# EAGLE schematic daughterboard (EAGLE 9.6.2)
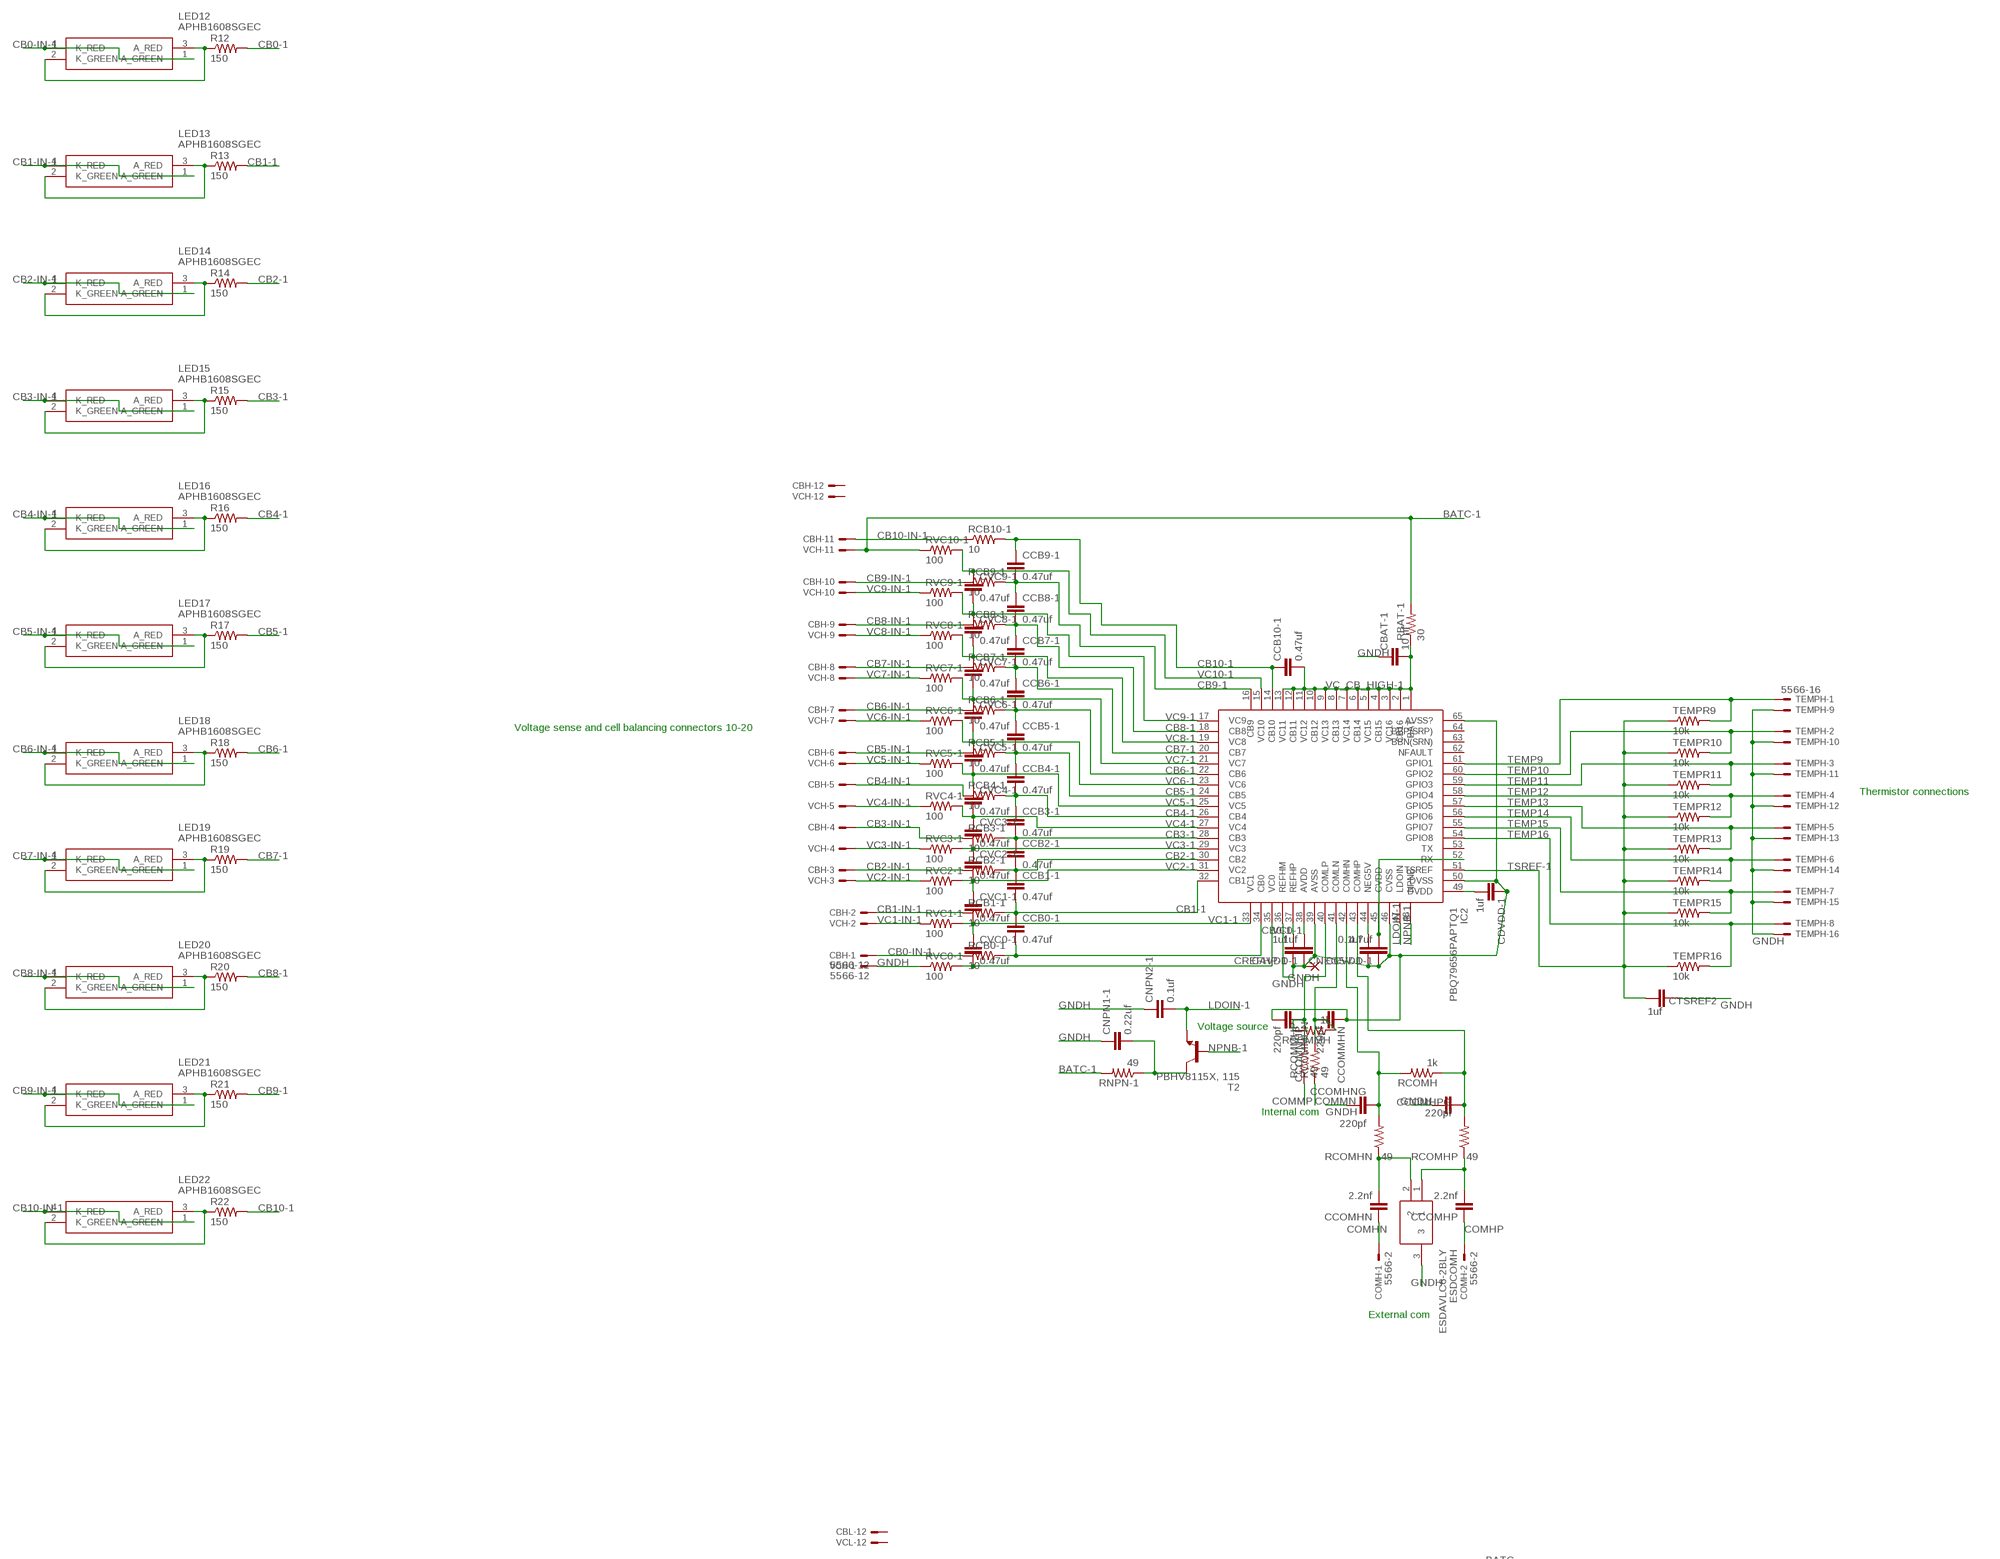
[diagram p0: schematic, sheet 1, part 1 of 2]
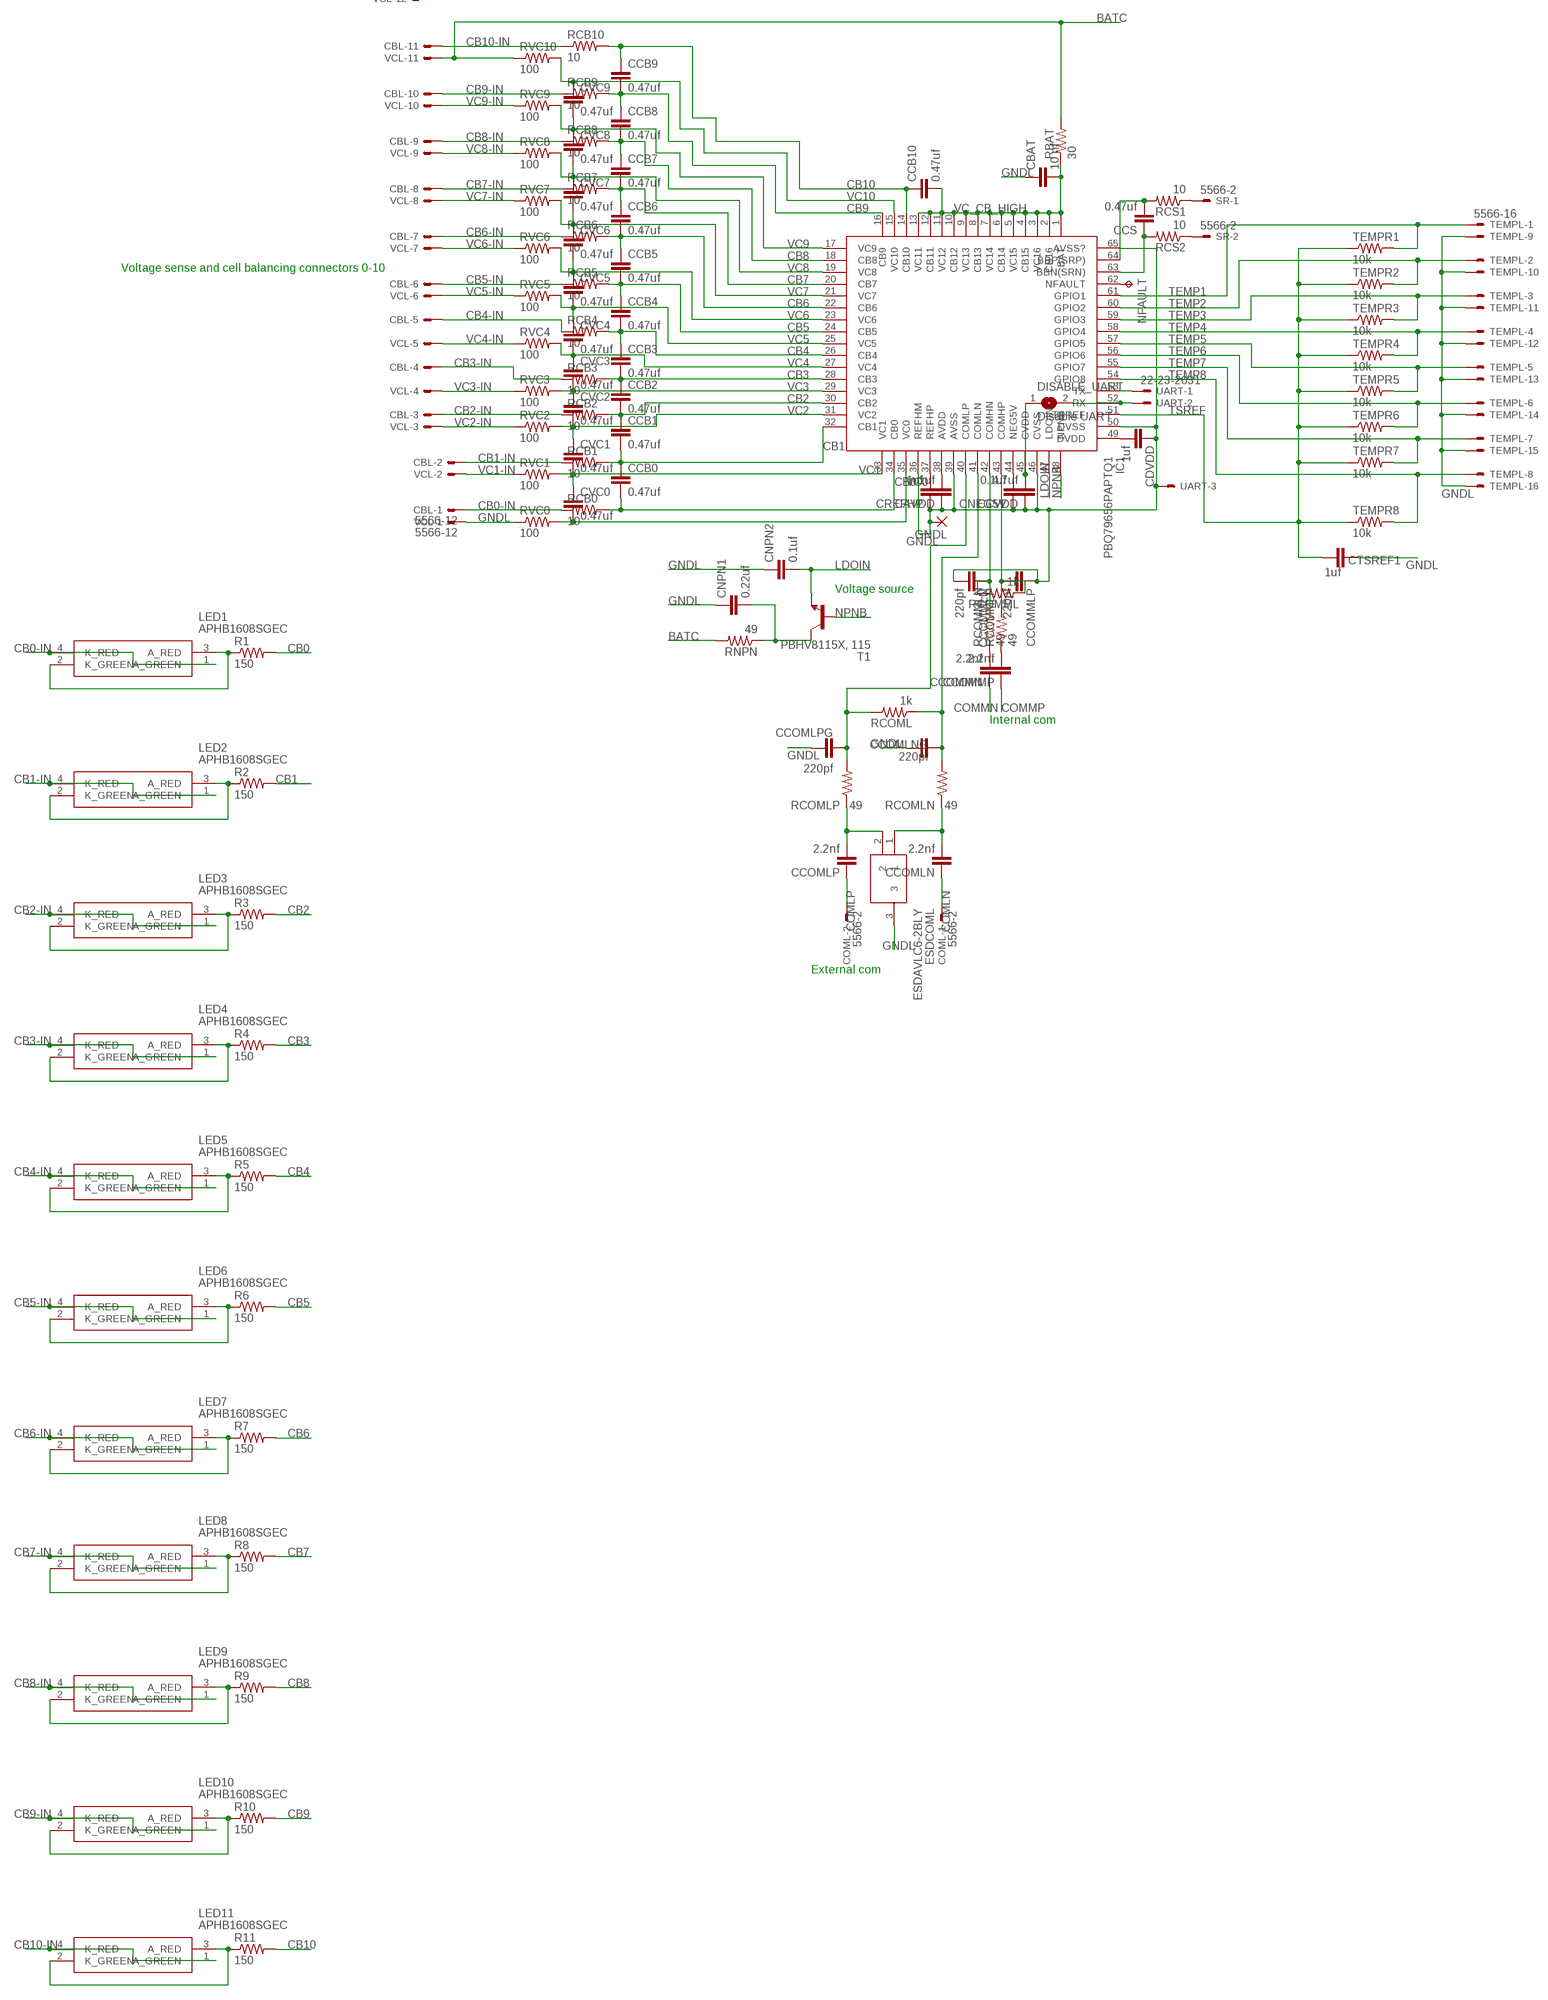
[diagram p1: schematic, sheet 1, part 2 of 2]

## Parts
CAVDD  1uf  C-EUC0603  [C0603]
CAVDD-1  1uf  C-EUC0603  [C0603]
CBAT  10 nf  C-EUC0603  [C0603]
CBAT-1  10 nf  C-EUC0603  [C0603]
CBH  5566-12  [5566-12]
CBL  5566-12  [5566-12]
CCB0  0.47uf  C-EUC0603  [C0603]
CCB0-1  0.47uf  C-EUC0603  [C0603]
CCB1  0.47uf  C-EUC0603  [C0603]
CCB1-1  0.47uf  C-EUC0603  [C0603]
CCB2  0.47uf  C-EUC0603  [C0603]
CCB2-1  0.47uf  C-EUC0603  [C0603]
CCB3  0.47uf  C-EUC0603  [C0603]
CCB3-1  0.47uf  C-EUC0603  [C0603]
CCB4  0.47uf  C-EUC0603  [C0603]
CCB4-1  0.47uf  C-EUC0603  [C0603]
CCB5  0.47uf  C-EUC0603  [C0603]
CCB5-1  0.47uf  C-EUC0603  [C0603]
CCB6  0.47uf  C-EUC0603  [C0603]
CCB6-1  0.47uf  C-EUC0603  [C0603]
CCB7  0.47uf  C-EUC0603  [C0603]
CCB7-1  0.47uf  C-EUC0603  [C0603]
CCB8  0.47uf  C-EUC0603  [C0603]
CCB8-1  0.47uf  C-EUC0603  [C0603]
CCB9  0.47uf  C-EUC0603  [C0603]
CCB9-1  0.47uf  C-EUC0603  [C0603]
CCB10  0.47uf  C-EUC0603  [C0603]
CCB10-1  0.47uf  C-EUC0603  [C0603]
CCOMHN  2.2nf  C-EUC0603  [C0603]
CCOMHNG  220pf  C-EUC0603  [C0603]
CCOMHP  2.2nf  C-EUC0603  [C0603]
CCOMHPG  220pf  C-EUC0603  [C0603]
CCOMLN  2.2nf  C-EUC0603  [C0603]
CCOMLNG  220pf  C-EUC0603  [C0603]
CCOMLP  2.2nf  C-EUC0603  [C0603]
CCOMLPG  220pf  C-EUC0603  [C0603]
CCOMMHN  220pf  C-EUC0603  [C0603]
CCOMMHP  220pf  C-EUC0603  [C0603]
CCOMMLN  220pf  C-EUC0603  [C0603]
CCOMMLP  220pf  C-EUC0603  [C0603]
CCOMMN  2.2nf  C-EUC0603  [C0603]
CCOMMP  2.2nf  C-EUC0603  [C0603]
CCS  0.47uf  C-EUC0603  [C0603]
CCVDD  4.7uf  C-EUC0603  [C0603]
CCVDD-1  4.7uf  C-EUC0603  [C0603]
CDVDD  1uf  C-EUC0603  [C0603]
CDVDD-1  1uf  C-EUC0603  [C0603]
CNEG5V  0.1uf  C-EUC0603  [C0603]
CNEG5V-1  0.1uf  C-EUC0603  [C0603]
CNPN1  0.22uf  C-EUC0603  [C0603]
CNPN1-1  0.22uf  C-EUC0603  [C0603]
CNPN2  0.1uf  C-EUC0603  [C0603]
CNPN2-1  0.1uf  C-EUC0603  [C0603]
COMH  5566-2  [5566-2]
COML  5566-2  [5566-2]
CREFHP  1uf  C-EUC0603  [C0603]
CREFHP-1  1uf  C-EUC0603  [C0603]
CTSREF1  1uf  C-EUC0603  [C0603]
CTSREF2  1uf  C-EUC0603  [C0603]
CVC0  0.47uf  C-EUC0603  [C0603]
CVC0-1  0.47uf  C-EUC0603  [C0603]
CVC1  0.47uf  C-EUC0603  [C0603]
CVC1-1  0.47uf  C-EUC0603  [C0603]
CVC2  0.47uf  C-EUC0603  [C0603]
CVC2-1  0.47uf  C-EUC0603  [C0603]
CVC3  0.47uf  C-EUC0603  [C0603]
CVC3-1  0.47uf  C-EUC0603  [C0603]
CVC4  0.47uf  C-EUC0603  [C0603]
CVC4-1  0.47uf  C-EUC0603  [C0603]
CVC5  0.47uf  C-EUC0603  [C0603]
CVC5-1  0.47uf  C-EUC0603  [C0603]
CVC6  0.47uf  C-EUC0603  [C0603]
CVC6-1  0.47uf  C-EUC0603  [C0603]
CVC7  0.47uf  C-EUC0603  [C0603]
CVC7-1  0.47uf  C-EUC0603  [C0603]
CVC8  0.47uf  C-EUC0603  [C0603]
CVC8-1  0.47uf  C-EUC0603  [C0603]
CVC9  0.47uf  C-EUC0603  [C0603]
CVC9-1  0.47uf  C-EUC0603  [C0603]
DISABLE_UART  Disable UART  SJ  [SJ]
ESDCOMH  ESDAVLC6-2BLY  [SOT95P255X150-3N]
ESDCOML  ESDAVLC6-2BLY  [SOT95P255X150-3N]
GNDH  SMD5  [SMD2,54-5,08]
GNDL  SMD5  [SMD2,54-5,08]
IC1  PBQ79656PAPTQ1  [QFP50P1200X1200X120-65N]
IC2  PBQ79656PAPTQ1  [QFP50P1200X1200X120-65N]
LED1  APHB1608SGEC  [APHB1608SGEC]
LED2  APHB1608SGEC  [APHB1608SGEC]
LED3  APHB1608SGEC  [APHB1608SGEC]
LED4  APHB1608SGEC  [APHB1608SGEC]
LED5  APHB1608SGEC  [APHB1608SGEC]
LED6  APHB1608SGEC  [APHB1608SGEC]
LED7  APHB1608SGEC  [APHB1608SGEC]
LED8  APHB1608SGEC  [APHB1608SGEC]
LED9  APHB1608SGEC  [APHB1608SGEC]
LED10  APHB1608SGEC  [APHB1608SGEC]
LED11  APHB1608SGEC  [APHB1608SGEC]
LED12  APHB1608SGEC  [APHB1608SGEC]
LED13  APHB1608SGEC  [APHB1608SGEC]
LED14  APHB1608SGEC  [APHB1608SGEC]
LED15  APHB1608SGEC  [APHB1608SGEC]
LED16  APHB1608SGEC  [APHB1608SGEC]
LED17  APHB1608SGEC  [APHB1608SGEC]
LED18  APHB1608SGEC  [APHB1608SGEC]
LED19  APHB1608SGEC  [APHB1608SGEC]
LED20  APHB1608SGEC  [APHB1608SGEC]
LED21  APHB1608SGEC  [APHB1608SGEC]
LED22  APHB1608SGEC  [APHB1608SGEC]
NFAULT  TPB2,54  [B2,54]
R1  150  R-US_R0603  [R0603]
R2  150  R-US_R0603  [R0603]
R3  150  R-US_R0603  [R0603]
R4  150  R-US_R0603  [R0603]
R5  150  R-US_R0603  [R0603]
R6  150  R-US_R0603  [R0603]
R7  150  R-US_R0603  [R0603]
R8  150  R-US_R0603  [R0603]
R9  150  R-US_R0603  [R0603]
R10  150  R-US_R0603  [R0603]
R11  150  R-US_R0603  [R0603]
R12  150  R-US_R0603  [R0603]
R13  150  R-US_R0603  [R0603]
R14  150  R-US_R0603  [R0603]
R15  150  R-US_R0603  [R0603]
R16  150  R-US_R0603  [R0603]
R17  150  R-US_R0603  [R0603]
R18  150  R-US_R0603  [R0603]
R19  150  R-US_R0603  [R0603]
R20  150  R-US_R0603  [R0603]
R21  150  R-US_R0603  [R0603]
R22  150  R-US_R0603  [R0603]
RBAT  30  R-US_R0603  [R0603]
RBAT-1  30  R-US_R0603  [R0603]
RCB0  10  R-US_R1210  [R1210]
RCB0-1  10  R-US_R1210  [R1210]
RCB1  10  R-US_R1210  [R1210]
RCB1-1  10  R-US_R1210  [R1210]
RCB2  10  R-US_R1210  [R1210]
RCB2-1  10  R-US_R1210  [R1210]
RCB3  10  R-US_R1210  [R1210]
RCB3-1  10  R-US_R1210  [R1210]
RCB4  10  R-US_R1210  [R1210]
RCB4-1  10  R-US_R1210  [R1210]
RCB5  10  R-US_R1210  [R1210]
RCB5-1  10  R-US_R1210  [R1210]
RCB6  10  R-US_R1210  [R1210]
RCB6-1  10  R-US_R1210  [R1210]
RCB7  10  R-US_R1210  [R1210]
RCB7-1  10  R-US_R1210  [R1210]
RCB8  10  R-US_R1210  [R1210]
RCB8-1  10  R-US_R1210  [R1210]
RCB9  10  R-US_R1210  [R1210]
RCB9-1  10  R-US_R1210  [R1210]
RCB10  10  R-US_R1210  [R1210]
RCB10-1  10  R-US_R1210  [R1210]
RCOMH  1k  R-US_R0603  [R0603]
RCOMHN  49  R-US_R0603  [R0603]
RCOMHP  49  R-US_R0603  [R0603]
RCOML  1k  R-US_R0603  [R0603]
RCOMLN  49  R-US_R0603  [R0603]
RCOMLP  49  R-US_R0603  [R0603]
RCOMMH  1k  R-US_R0603  [R0603]
RCOMMHN  49  R-US_R0603  [R0603]
RCOMMHP  49  R-US_R0603  [R0603]
RCOMML  1k  R-US_R0603  [R0603]
RCOMMLN  49  R-US_R0603  [R0603]
RCOMMLP  49  R-US_R0603  [R0603]
RCS1  10  R-US_R0603  [R0603]
RCS2  10  R-US_R0603  [R0603]
RNPN  49  R-US_R0603  [R0603]
RNPN-1  49  R-US_R0603  [R0603]
RVC0  100  R-US_R0603  [R0603]
RVC0-1  100  R-US_R0603  [R0603]
RVC1  100  R-US_R0603  [R0603]
RVC1-1  100  R-US_R0603  [R0603]
RVC2  100  R-US_R0603  [R0603]
RVC2-1  100  R-US_R0603  [R0603]
RVC3  100  R-US_R0603  [R0603]
RVC3-1  100  R-US_R0603  [R0603]
RVC4  100  R-US_R0603  [R0603]
RVC4-1  100  R-US_R0603  [R0603]
RVC5  100  R-US_R0603  [R0603]
RVC5-1  100  R-US_R0603  [R0603]
RVC6  100  R-US_R0603  [R0603]
RVC6-1  100  R-US_R0603  [R0603]
RVC7  100  R-US_R0603  [R0603]
RVC7-1  100  R-US_R0603  [R0603]
RVC8  100  R-US_R0603  [R0603]
RVC8-1  100  R-US_R0603  [R0603]
RVC9  100  R-US_R0603  [R0603]
RVC9-1  100  R-US_R0603  [R0603]
RVC10  100  R-US_R0603  [R0603]
RVC10-1  100  R-US_R0603  [R0603]
SR  5566-2  [5566-2]
T1  PBHV8115X, 115  BC868-NPN-SOT89-BCE  [SOT89-BCE]
T2  PBHV8115X, 115  BC868-NPN-SOT89-BCE  [SOT89-BCE]
TEMPH  5566-16  [5566-16]
TEMPL  5566-16  [5566-16]
TEMPR1  10k  R-US_R0603  [R0603]
TEMPR2  10k  R-US_R0603  [R0603]
TEMPR3  10k  R-US_R0603  [R0603]
TEMPR4  10k  R-US_R0603  [R0603]
TEMPR5  10k  R-US_R0603  [R0603]
TEMPR6  10k  R-US_R0603  [R0603]
TEMPR7  10k  R-US_R0603  [R0603]
TEMPR8  10k  R-US_R0603  [R0603]
TEMPR9  10k  R-US_R0603  [R0603]
TEMPR10  10k  R-US_R0603  [R0603]
TEMPR11  10k  R-US_R0603  [R0603]
TEMPR12  10k  R-US_R0603  [R0603]
TEMPR13  10k  R-US_R0603  [R0603]
TEMPR14  10k  R-US_R0603  [R0603]
TEMPR15  10k  R-US_R0603  [R0603]
TEMPR16  10k  R-US_R0603  [R0603]
UART  22-23-2031  [22-23-2031]
VCH  5566-12  [5566-12]
VCL  5566-12  [5566-12]

## Nets
BATC: RBAT.2 RNPN.2 RVC10.1 VCL.11
BATC-1: RBAT-1.2 RNPN-1.2 RVC10-1.1 VCH.11
CB0: CCB0.2 IC1.34(CB0) R1.2 RCB0.2
CB0-1: CCB0-1.2 IC2.34(CB0) R12.2 RCB0-1.2
CB0-IN: CBL.1 LED1.1(A_GREEN) LED1.4(K_RED) RCB0.1
CB0-IN-1: CBH.1 LED12.1(A_GREEN) LED12.4(K_RED) RCB0-1.1
CB1: CCB0.1 CCB1.2 IC1.32(CB1) R2.2 RCB1.2
CB1-1: CCB0-1.1 CCB1-1.2 IC2.32(CB1) R13.2 RCB1-1.2
CB1-IN: CBL.2 LED2.1(A_GREEN) LED2.4(K_RED) RCB1.1
CB1-IN-1: CBH.2 LED13.1(A_GREEN) LED13.4(K_RED) RCB1-1.1
CB2: CCB1.1 CCB2.2 IC1.30(CB2) R3.2 RCB2.2
CB2-1: CCB1-1.1 CCB2-1.2 IC2.30(CB2) R14.2 RCB2-1.2
CB2-IN: CBL.3 LED3.1(A_GREEN) LED3.4(K_RED) RCB2.1
CB2-IN-1: CBH.3 LED14.1(A_GREEN) LED14.4(K_RED) RCB2-1.1
CB3: CCB2.1 CCB3.2 IC1.28(CB3) R4.2 RCB3.2
CB3-1: CCB2-1.1 CCB3-1.2 IC2.28(CB3) R15.2 RCB3-1.2
CB3-IN: CBL.4 LED4.1(A_GREEN) LED4.4(K_RED) RCB3.1
CB3-IN-1: CBH.4 LED15.1(A_GREEN) LED15.4(K_RED) RCB3-1.1
CB4: CCB3.1 CCB4.2 IC1.26(CB4) R5.2 RCB4.2
CB4-1: CCB3-1.1 CCB4-1.2 IC2.26(CB4) R16.2 RCB4-1.2
CB4-IN: CBL.5 LED5.1(A_GREEN) LED5.4(K_RED) RCB4.1
CB4-IN-1: CBH.5 LED16.1(A_GREEN) LED16.4(K_RED) RCB4-1.1
CB5: CCB4.1 CCB5.2 IC1.24(CB5) R6.2 RCB5.2
CB5-1: CCB4-1.1 CCB5-1.2 IC2.24(CB5) R17.2 RCB5-1.2
CB5-IN: CBL.6 LED6.1(A_GREEN) LED6.4(K_RED) RCB5.1
CB5-IN-1: CBH.6 LED17.1(A_GREEN) LED17.4(K_RED) RCB5-1.1
CB6: CCB5.1 CCB6.2 IC1.22(CB6) R7.2 RCB6.2
CB6-1: CCB5-1.1 CCB6-1.2 IC2.22(CB6) R18.2 RCB6-1.2
CB6-IN: CBL.7 LED7.1(A_GREEN) LED7.4(K_RED) RCB6.1
CB6-IN-1: CBH.7 LED18.1(A_GREEN) LED18.4(K_RED) RCB6-1.1
CB7: CCB6.1 CCB7.2 IC1.20(CB7) R8.2 RCB7.2
CB7-1: CCB6-1.1 CCB7-1.2 IC2.20(CB7) R19.2 RCB7-1.2
CB7-IN: CBL.8 LED8.1(A_GREEN) LED8.4(K_RED) RCB7.1
CB7-IN-1: CBH.8 LED19.1(A_GREEN) LED19.4(K_RED) RCB7-1.1
CB8: CCB7.1 CCB8.2 IC1.18(CB8) R9.2 RCB8.2
CB8-1: CCB7-1.1 CCB8-1.2 IC2.18(CB8) R20.2 RCB8-1.2
CB8-IN: CBL.9 LED9.1(A_GREEN) LED9.4(K_RED) RCB8.1
CB8-IN-1: CBH.9 LED20.1(A_GREEN) LED20.4(K_RED) RCB8-1.1
CB9: CCB8.1 CCB9.2 IC1.16(CB9) R10.2 RCB9.2
CB9-1: CCB8-1.1 CCB9-1.2 IC2.16(CB9) R21.2 RCB9-1.2
CB9-IN: CBL.10 LED10.1(A_GREEN) LED10.4(K_RED) RCB9.1
CB9-IN-1: CBH.10 LED21.1(A_GREEN) LED21.4(K_RED) RCB9-1.1
CB10: CCB9.1 CCB10.1 IC1.14(CB10) R11.2 RCB10.2
CB10-1: CCB9-1.1 CCB10-1.1 IC2.14(CB10) R22.2 RCB10-1.2
CB10-IN: CBL.11 LED11.1(A_GREEN) LED11.4(K_RED) RCB10.1
CB10-IN-1: CBH.11 LED22.1(A_GREEN) LED22.4(K_RED) RCB10-1.1
COMHN: CCOMHN.1 COMH.1
COMHP: CCOMHP.1 COMH.2
COMLN: CCOMLN.1 COML.1
COMLP: CCOMLP.1 COML.2
COMMN: CCOMMN.1 RCOMMHN.1
COMMP: CCOMMP.1 RCOMMHP.1
CVDD: CCVDD.2 DISABLE_UART.1 IC1.45(CVDD)
CVDD-1: CCVDD-1.2 IC2.45(CVDD) IC2.52(RX)
GNDH: CAVDD-1.1 CBAT-1.1 CCOMHNG.1 CCOMHPG.1 CCOMMHN.1 CCOMMHP.2 CCVDD-1.1 CDVDD-1.1 CNEG5V-1.1 CNPN1-1.1 CNPN2-1.1 CREFHP-1.1 CTSREF2.1 ESDCOMH.3 GNDH.1(P) IC2.36(REFHM) IC2.39(AVSS) IC2.46(CVSS) IC2.50(DVSS) IC2.65(AVSS?) RVC0-1.1 TEMPH.9 TEMPH.10 TEMPH.11 TEMPH.12 TEMPH.13 TEMPH.14 TEMPH.15 TEMPH.16 VCH.1
GNDL: CAVDD.1 CBAT.1 CCOMLNG.1 CCOMLPG.1 CCOMMLN.2 CCOMMLP.1 CCVDD.1 CDVDD.1 CNEG5V.1 CNPN1.1 CNPN2.1 CREFHP.1 CTSREF1.1 ESDCOML.3 GNDL.1(P) IC1.36(REFHM) IC1.39(AVSS) IC1.46(CVSS) IC1.50(DVSS) IC1.65(AVSS?) RVC0.1 TEMPL.9 TEMPL.10 TEMPL.11 TEMPL.12 TEMPL.13 TEMPL.14 TEMPL.15 TEMPL.16 UART.3 VCL.1
LDOIN: CNPN2.2 IC1.47(LDOIN) T1.E
LDOIN-1: CNPN2-1.2 IC2.47(LDOIN) T2.E
N$1: CCOMHP.2 ESDCOMH.1 RCOMHP.1
N$2: CCOMHN.2 ESDCOMH.2 RCOMHN.1
N$3: DISABLE_UART.2 IC1.52(RX) UART.2
N$4: CCS.2 IC1.64(BBP(SRP)) RCS1.2
N$5: LED12.2(K_GREEN) LED12.3(A_RED) R12.1
N$6: LED2.2(K_GREEN) LED2.3(A_RED) R2.1
N$7: CCS.1 IC1.63(BBN(SRN)) RCS2.2
N$8: LED13.2(K_GREEN) LED13.3(A_RED) R13.1
N$9: IC1.53(TX) UART.1
N$10: IC1.62(NFAULT) NFAULT.TP
N$11: LED14.2(K_GREEN) LED14.3(A_RED) R14.1
N$12: LED3.2(K_GREEN) LED3.3(A_RED) R3.1
N$13: RCS2.1 SR.2
N$14: LED15.2(K_GREEN) LED15.3(A_RED) R15.1
N$15: LED16.2(K_GREEN) LED16.3(A_RED) R16.1
N$16: RCS1.1 SR.1
N$17: LED17.2(K_GREEN) LED17.3(A_RED) R17.1
N$18: LED4.2(K_GREEN) LED4.3(A_RED) R4.1
N$19: LED18.2(K_GREEN) LED18.3(A_RED) R18.1
N$20: LED19.2(K_GREEN) LED19.3(A_RED) R19.1
N$21: LED5.2(K_GREEN) LED5.3(A_RED) R5.1
N$22: LED20.2(K_GREEN) LED20.3(A_RED) R20.1
N$23: LED21.2(K_GREEN) LED21.3(A_RED) R21.1
N$24: LED6.2(K_GREEN) LED6.3(A_RED) R6.1
N$25: LED22.2(K_GREEN) LED22.3(A_RED) R22.1
N$27: LED7.2(K_GREEN) LED7.3(A_RED) R7.1
N$29: CCOMLNG.2 IC1.41(COMLN) RCOML.1 RCOMLN.2
N$31: LED8.2(K_GREEN) LED8.3(A_RED) R8.1
N$33: CREFHP.2 IC1.37(REFHP)
N$35: LED9.2(K_GREEN) LED9.3(A_RED) R9.1
N$38: LED10.2(K_GREEN) LED10.3(A_RED) R10.1
N$41: LED11.2(K_GREEN) LED11.3(A_RED) R11.1
N$43: LED1.2(K_GREEN) LED1.3(A_RED) R1.1
N$46: CAVDD.2 IC1.38(AVDD)
N$48: CNEG5V.2 IC1.44(NEG5V)
N$49: CCOMLPG.2 IC1.40(COMLP) RCOML.2 RCOMLP.2
N$50: CDVDD.2 IC1.49(DVDD)
N$59: CCOMMLN.1 IC1.42(COMHN) RCOMML.2 RCOMMLN.2
N$60: CCOMMLP.2 IC1.43(COMHP) RCOMML.1 RCOMMLP.2
N$61: CCOMMN.2 RCOMMLN.1
N$62: CCOMMP.2 RCOMMLP.1
N$65: CNPN1.2 RNPN.1 T1.C
N$67: CCOMLP.2 ESDCOML.2 RCOMLP.1
N$68: CCOMLN.2 ESDCOML.1 RCOMLN.1
N$111: CREFHP-1.2 IC2.37(REFHP)
N$112: CAVDD-1.2 IC2.38(AVDD)
N$113: CNEG5V-1.2 IC2.44(NEG5V)
N$114: CDVDD-1.2 IC2.49(DVDD)
N$125: CCOMMHN.2 IC2.41(COMLN) RCOMMH.1 RCOMMHN.2
N$126: CCOMMHP.1 IC2.40(COMLP) RCOMMH.2 RCOMMHP.2
N$130: CNPN1-1.2 RNPN-1.1 T2.C
N$131: CCOMHPG.2 IC2.43(COMHP) RCOMH.1 RCOMHP.2
N$132: CCOMHNG.2 IC2.42(COMHN) RCOMH.2 RCOMHN.2
NPNB: IC1.48(NPNB) T1.B
NPNB-1: IC2.48(NPNB) T2.B
TEMP1: IC1.61(GPIO1) TEMPL.1 TEMPR1.2
TEMP2: IC1.60(GPIO2) TEMPL.2 TEMPR2.2
TEMP3: IC1.59(GPIO3) TEMPL.3 TEMPR3.2
TEMP4: IC1.58(GPIO4) TEMPL.4 TEMPR4.2
TEMP5: IC1.57(GPIO5) TEMPL.5 TEMPR5.2
TEMP6: IC1.56(GPIO6) TEMPL.6 TEMPR6.2
TEMP7: IC1.55(GPIO7) TEMPL.7 TEMPR7.2
TEMP8: IC1.54(GPIO8) TEMPL.8 TEMPR8.2
TEMP9: IC2.61(GPIO1) TEMPH.1 TEMPR9.2
TEMP10: IC2.60(GPIO2) TEMPH.2 TEMPR10.2
TEMP11: IC2.59(GPIO3) TEMPH.3 TEMPR11.2
TEMP12: IC2.58(GPIO4) TEMPH.4 TEMPR12.2
TEMP13: IC2.57(GPIO5) TEMPH.5 TEMPR13.2
TEMP14: IC2.56(GPIO6) TEMPH.6 TEMPR14.2
TEMP15: IC2.55(GPIO7) TEMPH.7 TEMPR15.2
TEMP16: IC2.54(GPIO8) TEMPH.8 TEMPR16.2
TSREF: CTSREF1.2 IC1.51(TSREF) TEMPR1.1 TEMPR2.1 TEMPR3.1 TEMPR4.1 TEMPR5.1 TEMPR6.1 TEMPR7.1 TEMPR8.1
TSREF-1: CTSREF2.2 IC2.51(TSREF) TEMPR9.1 TEMPR10.1 TEMPR11.1 TEMPR12.1 TEMPR13.1 TEMPR14.1 TEMPR15.1 TEMPR16.1
VC0: CVC0.2 IC1.35(VC0) RVC0.2
VC0-1: CVC0-1.2 IC2.35(VC0) RVC0-1.2
VC1: CVC0.1 CVC1.2 IC1.33(VC1) RVC1.2
VC1-1: CVC0-1.1 CVC1-1.2 IC2.33(VC1) RVC1-1.2
VC1-IN: RVC1.1 VCL.2
VC1-IN-1: RVC1-1.1 VCH.2
VC2: CVC1.1 CVC2.2 IC1.31(VC2) RVC2.2
VC2-1: CVC1-1.1 CVC2-1.2 IC2.31(VC2) RVC2-1.2
VC2-IN: RVC2.1 VCL.3
VC2-IN-1: RVC2-1.1 VCH.3
VC3: CVC2.1 CVC3.2 IC1.29(VC3) RVC3.2
VC3-1: CVC2-1.1 CVC3-1.2 IC2.29(VC3) RVC3-1.2
VC3-IN: RVC3.1 VCL.4
VC3-IN-1: RVC3-1.1 VCH.4
VC4: CVC3.1 CVC4.2 IC1.27(VC4) RVC4.2
VC4-1: CVC3-1.1 CVC4-1.2 IC2.27(VC4) RVC4-1.2
VC4-IN: RVC4.1 VCL.5
VC4-IN-1: RVC4-1.1 VCH.5
VC5: CVC4.1 CVC5.2 IC1.25(VC5) RVC5.2
VC5-1: CVC4-1.1 CVC5-1.2 IC2.25(VC5) RVC5-1.2
VC5-IN: RVC5.1 VCL.6
VC5-IN-1: RVC5-1.1 VCH.6
VC6: CVC5.1 CVC6.2 IC1.23(VC6) RVC6.2
VC6-1: CVC5-1.1 CVC6-1.2 IC2.23(VC6) RVC6-1.2
VC6-IN: RVC6.1 VCL.7
VC6-IN-1: RVC6-1.1 VCH.7
VC7: CVC6.1 CVC7.2 IC1.21(VC7) RVC7.2
VC7-1: CVC6-1.1 CVC7-1.2 IC2.21(VC7) RVC7-1.2
VC7-IN: RVC7.1 VCL.8
VC7-IN-1: RVC7-1.1 VCH.8
VC8: CVC7.1 CVC8.2 IC1.19(VC8) RVC8.2
VC8-1: CVC7-1.1 CVC8-1.2 IC2.19(VC8) RVC8-1.2
VC8-IN: RVC8.1 VCL.9
VC8-IN-1: RVC8-1.1 VCH.9
VC9: CVC8.1 CVC9.2 IC1.17(VC9) RVC9.2
VC9-1: CVC8-1.1 CVC9-1.2 IC2.17(VC9) RVC9-1.2
VC9-IN: RVC9.1 VCL.10
VC9-IN-1: RVC9-1.1 VCH.10
VC10: CVC9.1 IC1.15(VC10) RVC10.2
VC10-1: CVC9-1.1 IC2.15(VC10) RVC10-1.2
VC_CB_HIGH: CBAT.2 CCB10.2 IC1.1(BAT) IC1.2(CB16) IC1.3(VC16) IC1.4(CB15) IC1.5(VC15) IC1.6(CB14) IC1.7(VC14) IC1.8(CB13) IC1.9(VC13) IC1.10(CB12) IC1.11(VC12) IC1.12(CB11) IC1.13(VC11) RBAT.1
VC_CB_HIGH-1: CBAT-1.2 CCB10-1.2 IC2.1(BAT) IC2.2(CB16) IC2.3(VC16) IC2.4(CB15) IC2.5(VC15) IC2.6(CB14) IC2.7(VC14) IC2.8(CB13) IC2.9(VC13) IC2.10(CB12) IC2.11(VC12) IC2.12(CB11) IC2.13(VC11) RBAT-1.1
Unconnected: CBH.12 CBL.12 IC2.53(TX) IC2.62(NFAULT) IC2.63(BBN(SRN)) IC2.64(BBP(SRP)) VCH.12 VCL.12

## Notes on the sheet
- Voltage sense and cell balancing connectors 10-20
- Thermistor connections
- Voltage source
- Internal com
- External com
- Voltage sense and cell balancing connectors 0-10
- Voltage source
- Internal com
- External com

## Library data of the parts
CAVDD CAVDD-1 CBAT CBAT-1 CCB0 CCB0-1 CCB1 CCB1-1 CCB2 CCB2-1 CCB3 CCB3-1 CCB4 CCB4-1 CCB5 CCB5-1 CCB6 CCB6-1 CCB7 CCB7-1 CCB8 CCB8-1 CCB9 CCB9-1 CCB10 CCB10-1 CCOMHN CCOMHNG CCOMHP CCOMHPG CCOMLN CCOMLNG CCOMLP CCOMLPG CCOMMHN CCOMMHP CCOMMLN CCOMMLP CCOMMN CCOMMP CCS CCVDD CCVDD-1 CDVDD CDVDD-1 CNEG5V CNEG5V-1 CNPN1 CNPN1-1 CNPN2 CNPN2-1 CREFHP CREFHP-1 CTSREF1 CTSREF2 CVC0 CVC0-1 CVC1 CVC1-1 CVC2 CVC2-1 CVC3 CVC3-1 CVC4 CVC4-1 CVC5 CVC5-1 CVC6 CVC6-1 CVC7 CVC7-1 CVC8 CVC8-1 CVC9 CVC9-1 = rcl:C-EU: CAPACITOR, European symbol; SPICEPREFIX: C
CBH CBL VCH VCL = con-molex:5566-12: Mini FIT connector 12 pol Source: http://www.molex.com; MF: MOLEX; OC_FARNELL: unknown; OC_NEWARK: unknown
COMH COML SR = con-molex:5566-2: Mini FIT connector 2 pol Source: http://www.molex.com; MF: MOLEX; OC_FARNELL: 1822072; OC_NEWARK: unknown
DISABLE_UART = jumper:SJ: SMD solder JUMPER
ESDCOMH ESDCOML = ESDAVLC6-2BLY:ESDAVLC6-2BLY: STMICROELECTRONICS - ESDAVLC6-2BLY - ESD Protection Device, 17 V, SOT-23, 3 Pins, 5 V, 140 W, ESDA Transil Series Source: Datasheet <http://www.st.com/resource/en/datasheet/esdavlc6-2bly.pdf>; DESCRIPTION: STMICROELECTRONICS - ESDAVLC6-2BLY - ESD Protection Device, 17 V, SOT-23, 3 Pins, 5 V, 140 W, ESDA Transil Series; HEIGHT: 1.5mm; MANUFACTURER_NAME: STMicroelectronics; MANUFACTURER_PART_NUMBER: ESDAVLC6-2BLY; MOUSER_PART_NUMBER: 511-ESDAVLC6-2BLY; MOUSER_PRICE-STOCK: https://www.mouser.co.uk/ProductDetail/STMicroelectronics/ESDAVLC6-2BLY?qs=l7cgNqFNU1iH2e21evvYsA%3D%3D
GNDH GNDL = wirepad:SMD5: SMD PAD
IC1 IC2 = PBQ79656PAPTQ1:PBQ79656PAPTQ1: BQ7965x-Q1 Family of 12S, 14S, 16S Precision Automotive Battery Monitor, Balancer and Integrated Hardware Protector with up to SafeTITM-26262 ASIL-D Compliance Source: Datasheet <http://www.ti.com/lit/ds/symlink/bq79616-q1.pdf>; DESCRIPTION: BQ7965x-Q1 Family of 12S, 14S, 16S Precision Automotive Battery Monitor, Balancer and Integrated Hardware Protector with up to SafeTITM-26262 ASIL-D Compliance; HEIGHT: 1.2mm; MANUFACTURER_NAME: Texas Instruments; MANUFACTURER_PART_NUMBER: PBQ79656PAPTQ1
LED1-LED22 = APHB1608SGEC:APHB1608SGEC: Standard LEDs - SMD Grn/Red 15/15mcd 568/625nm Water Clr Source: Datasheet <https://componentsearchengine.com/Datasheets/1/APHB1608SGEC.pdf>; DESCRIPTION: Standard LEDs - SMD Grn/Red 15/15mcd 568/625nm Water Clr; HEIGHT: 0.65mm; MANUFACTURER_NAME: Kingbright; MANUFACTURER_PART_NUMBER: APHB1608SGEC; MOUSER_PART_NUMBER: 604-APHB1608SGEC; MOUSER_PRICE-STOCK: https://www.mouser.co.uk/ProductDetail/Kingbright/APHB1608SGEC?qs=WZYOKEqGBpLhrRIHB2dNew%3D%3D
NFAULT = testpad:TP: Test pad
R1-R22 RBAT RBAT-1 RCB0 RCB0-1 RCB1 RCB1-1 RCB2 RCB2-1 RCB3 RCB3-1 RCB4 RCB4-1 RCB5 RCB5-1 RCB6 RCB6-1 RCB7 RCB7-1 RCB8 RCB8-1 RCB9 RCB9-1 RCB10 RCB10-1 RCOMH RCOMHN RCOMHP RCOML RCOMLN RCOMLP RCOMMH RCOMMHN RCOMMHP RCOMML RCOMMLN RCOMMLP RCS1 RCS2 RNPN RNPN-1 RVC0 RVC0-1 RVC1 RVC1-1 RVC2 RVC2-1 RVC3 RVC3-1 RVC4 RVC4-1 RVC5 RVC5-1 RVC6 RVC6-1 RVC7 RVC7-1 RVC8 RVC8-1 RVC9 RVC9-1 RVC10 RVC10-1 TEMPR1-TEMPR16 = rcl:R-US_: RESISTOR, American symbol; SPICEPREFIX: R
T1 T2 = transistor:*-NPN-: NPN Transistror BF959 corrected 2008.03.06
TEMPH TEMPL = con-molex:5566-16: Mini FIT connector 16 pol Source: http://www.molex.com; MF: MOLEX; OC_FARNELL: unknown; OC_NEWARK: unknown
UART = con-molex:22-23-2031: .100" (2.54mm) Center Header - 3 Pin; MF: MOLEX; MPN: 22-23-2031; OC_FARNELL: 1462950; OC_NEWARK: 30C0862